# EAGLE design usbtrng (EAGLE 6.2)
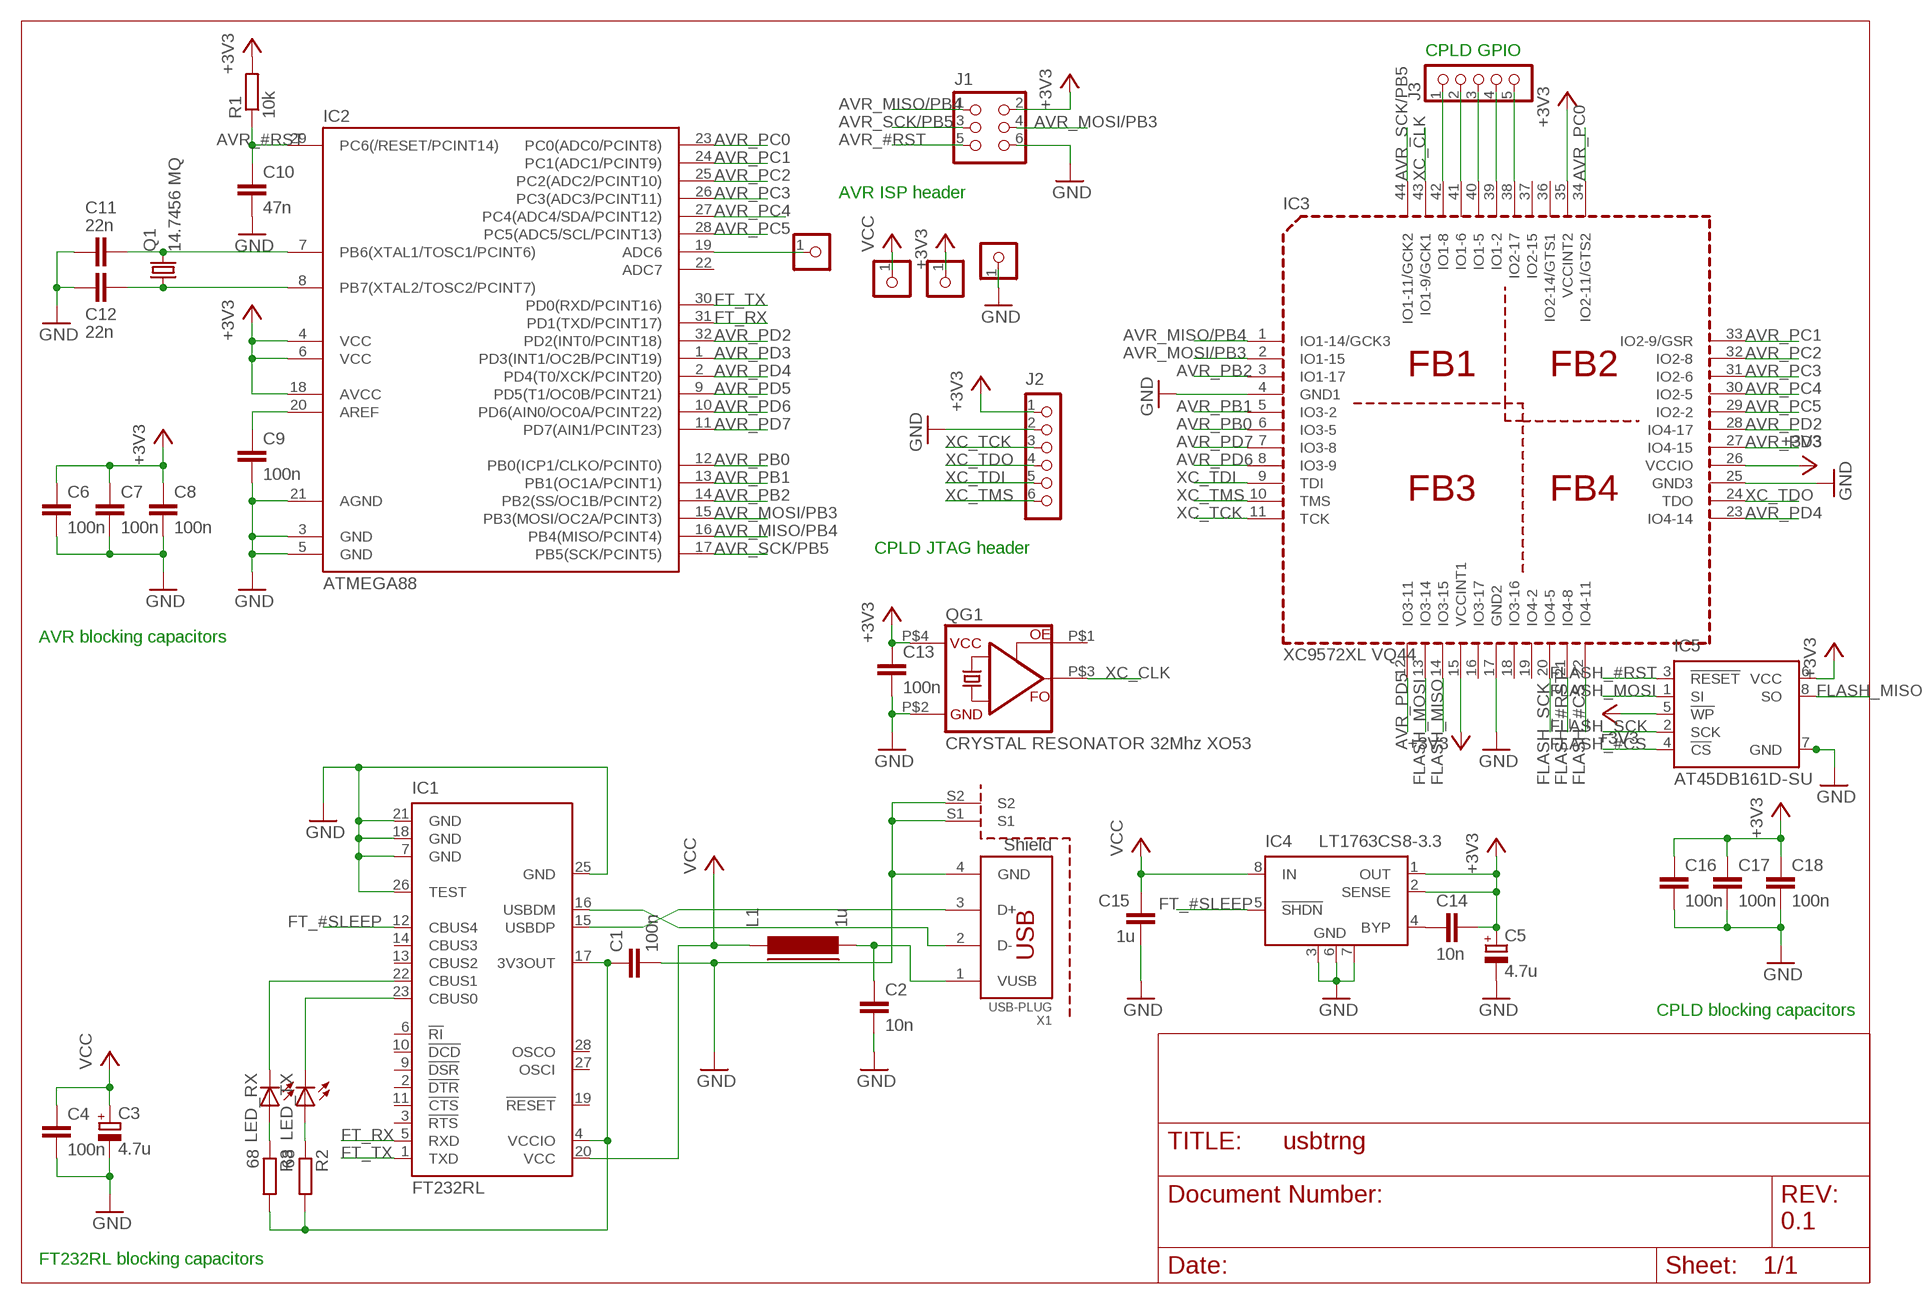
[diagram p0: schematic, sheet 1]

## Parts
C1  100n  C-EUC0805  [C0805]
C2  10n  C-EUC0805  [C0805]
C3  4.7u  CPOL-EUB  [PANASONIC_B]
C4  100n  C-EUC0805  [C0805]
C5  4.7u  CPOL-EUB  [PANASONIC_B]
C6  100n  C-EUC0805  [C0805]
C7  100n  C-EUC0805  [C0805]
C8  100n  C-EUC0805  [C0805]
C9  100n  C-EUC0805  [C0805]
C10  47n  C-EUC0805  [C0805]
C11  22n  C-EUC0805  [C0805]
C12  22n  C-EUC0805  [C0805]
C13  100n  C-EUC0805  [C0805]
C14  10n  C-EUC0805  [C0805]
C15  1u  C-EUC0805  [C0805]
C16  100n  C-EUC0805  [C0805]
C17  100n  C-EUC0805  [C0805]
C18  100n  C-EUC0805  [C0805]
IC1  FT232RL  [SSOP28]
IC2  ATMEGA88  ATMEGA48/88/168-AU  [TQFP32-08]
IC3  XC9572XL VQ44  IC_CPLD_XC9572VQ44  [VQ-44]
IC4  LT1763CS8-3.3  [SOIC8]
IC5  AT45DB161D-SU  [8S2]
J1  CON_HEADER_2X03-PTH  [M2X3]
J2  CON_HEADER_1X06-PTH  [M1X6]
J3  CON_HEADER_1X05-PTH  [M1X5]
J4  CON_HEADER_1X01-PTH  [M1X1]
J5  CON_HEADER_1X01-PTH  [M1X1]
J7  CON_HEADER_1X01-PTH  [M1X1]
J8  CON_HEADER_1X01-PTH  [M1X1]
L1  1u  FERRITE-0805  [FB805]
LED_RX  LEDCHIP-LED0805  [CHIP-LED0805]
LED_TX  LEDCHIP-LED0805  [CHIP-LED0805]
Q1  14.7456 MQ  CRYSTALMJ  [MJ]
QG1  CRYSTAL RESONATOR 32Mhz XO53  CRYSTALRESONATORXO53  [XO53]
R1  10k  R-EU_M0805  [M0805]
R2  68  R-EU_M0805  [M0805]
R3  68  R-EU_M0805  [M0805]
X1  USB-PLUG  USB-1X-2S-PLUG-A-SMD  [USB-PLUG-A-SMD-2S]

## Nets
+3V3: C5.+ C6.1 C7.1 C8.1 C13.1 C14.2 C16.1 C17.1 C18.1 IC2.4(VCC) IC2.6(VCC) IC2.18(AVCC) IC3.15(VCCINT1) IC3.26(VCCIO) IC3.35(VCCINT2) IC4.1(OUT) IC4.2(SENSE) IC5.5(!WP) IC5.6(VCC) J1.2 J2.1 J7.1 QG1.P$4(VCC) R1.2
AVR_#RST: C10.1 IC2.29(PC6(/RESET/PCINT14)) J1.5 R1.1
AVR_MISO/PB4: IC2.16(PB4(MISO/PCINT4)) IC3.1(IO1-14/GCK3) J1.1
AVR_MOSI/PB3: IC2.15(PB3(MOSI/OC2A/PCINT3)) IC3.2(IO1-15) J1.4
AVR_PB0: IC2.12(PB0(ICP1/CLKO/PCINT0)) IC3.6(IO3-5)
AVR_PB1: IC2.13(PB1(OC1A/PCINT1)) IC3.5(IO3-2)
AVR_PB2: IC2.14(PB2(SS/OC1B/PCINT2)) IC3.3(IO1-17)
AVR_PC0: IC2.23(PC0(ADC0/PCINT8)) IC3.34(IO2-11/GTS2)
AVR_PC1: IC2.24(PC1(ADC1/PCINT9)) IC3.33(IO2-9/GSR)
AVR_PC2: IC2.25(PC2(ADC2/PCINT10)) IC3.32(IO2-8)
AVR_PC3: IC2.26(PC3(ADC3/PCINT11)) IC3.31(IO2-6)
AVR_PC4: IC2.27(PC4(ADC4/SDA/PCINT12)) IC3.30(IO2-5)
AVR_PC5: IC2.28(PC5(ADC5/SCL/PCINT13)) IC3.29(IO2-2)
AVR_PD2: IC2.32(PD2(INT0/PCINT18)) IC3.28(IO4-17)
AVR_PD3: IC2.1(PD3(INT1/OC2B/PCINT19)) IC3.27(IO4-15)
AVR_PD4: IC2.2(PD4(T0/XCK/PCINT20)) IC3.23(IO4-14)
AVR_PD5: IC2.9(PD5(T1/OC0B/PCINT21)) IC3.12(IO3-11)
AVR_PD6: IC2.10(PD6(AIN0/OC0A/PCINT22)) IC3.8(IO3-9)
AVR_PD7: IC2.11(PD7(AIN1/PCINT23)) IC3.7(IO3-8)
AVR_SCK/PB5: IC2.17(PB5(SCK/PCINT5)) IC3.44(IO1-11/GCK2) J1.3
FLASH_#CS: IC3.22(IO4-11) IC5.4(!CS)
FLASH_#RST: IC3.21(IO4-8) IC5.3(!RESET)
FLASH_MISO: IC3.14(IO3-15) IC5.8(SO)
FLASH_MOSI: IC3.13(IO3-14) IC5.1(SI)
FLASH_SCK: IC3.20(IO4-5) IC5.2(SCK)
FT_#SLEEP: IC1.12(CBUS4) IC4.5(!SHDN)
FT_RX: IC1.5(RXD) IC2.31(PD1(TXD/PCINT17))
FT_TX: IC1.1(TXD) IC2.30(PD0(RXD/PCINT16))
GND: C1.2 C2.2 C3.- C4.2 C5.- C6.2 C7.2 C8.2 C9.2 C10.2 C11.1 C12.1 C13.2 C15.1 C16.2 C17.2 C18.2 IC1.7(GND) IC1.18(GND) IC1.21(GND) IC1.25(GND) IC1.26(TEST) IC2.3(GND) IC2.5(GND) IC2.21(AGND) IC3.4(GND1) IC3.17(GND2) IC3.25(GND3) IC4.3(GND) IC4.6(GND) IC4.7(GND) IC5.7(GND) J1.6 J2.2 J5.1 QG1.P$2(GND) X1.4(GND) X1.S1 X1.S2
N$1: IC1.15(USBDP) X1.3(D+)
N$2: IC1.16(USBDM) X1.2(D-)
N$3: C9.1 IC2.20(AREF)
N$4: C2.1 L1.2 X1.1(VUSB)
N$5: LED_RX.A R3.1
N$6: C1.1 IC1.4(VCCIO) IC1.17(3V3OUT) R2.2 R3.2
N$7: LED_TX.A R2.1
N$8: IC1.23(CBUS0) LED_TX.C
N$9: IC1.22(CBUS1) LED_RX.C
N$10: C11.2 IC2.7(PB6(XTAL1/TOSC1/PCINT6)) Q1.P3
N$11: C12.2 IC2.8(PB7(XTAL2/TOSC2/PCINT7)) Q1.P1
N$12: IC3.42(IO1-8) J3.1
N$13: C14.1 IC4.4(BYP)
N$14: IC3.41(IO1-6) J3.2
N$15: IC3.40(IO1-5) J3.3
N$16: IC3.39(IO1-2) J3.4
N$17: IC3.38(IO2-17) J3.5
N$18: IC2.19(ADC6) J4.1
VCC: C3.+ C4.1 C15.2 IC1.20(VCC) IC4.8(IN) J8.1 L1.1
XC_CLK: IC3.43(IO1-9/GCK1) QG1.P$3(FO)
XC_TCK: IC3.11(TCK) J2.3
XC_TDI: IC3.9(TDI) J2.5
XC_TDO: IC3.24(TDO) J2.4
XC_TMS: IC3.10(TMS) J2.6
Unconnected: IC1.2(!DTR) IC1.3(!RTS) IC1.6(!RI) IC1.9(!DSR) IC1.10(!DCD) IC1.11(!CTS) IC1.13(CBUS2) IC1.14(CBUS3) IC1.19(!RESET) IC1.27(OSCI) IC1.28(OSCO) IC2.22(ADC7) IC3.16(IO3-17) IC3.18(IO3-16) IC3.19(IO4-2) IC3.36(IO2-14/GTS1) IC3.37(IO2-15) Q1.P2(GND) Q1.P4(GND1) QG1.P$1(OE)

## Notes on the sheet
- CPLD GPIO
- AVR ISP header
- CPLD JTAG header
- AVR blocking capacitors
- CPLD blocking capacitors
- 0.1
- FT232RL blocking capacitors

## Library data of the parts
C1 C2 C4 C6-C18 = rcl:C-EU: CAPACITOR, European symbol
C3 C5 = rcl:CPOL-EU: POLARIZED CAPACITOR, European symbol
IC1 = ftdichip:FT232R: Source: http://www.ftdichip.com/Documents/DataSheets/DS_FT232R_v104.pdf; MPN: FT232RL; OC_FARNELL: 1146032; OC_NEWARK: 91K9918
IC2 = atmega8:ATMEGA48/88/168
IC3 = dp_devices:IC_CPLD_XC9572
IC4 = linear-technology:LT1763CS8: 500mA, Low Noise, LDO Micropower Regulators Source: http://cds.linear.com/docs/Datasheet/1763ff.pdf; MPN: LT1763CS8-3.3; OC_FARNELL: 1273617; OC_NEWARK: 57M6055
IC5 = atmel:AT45DB161D: 16-megabit 2.5V or 2.7V DataFlash Source: http://www.atmel.com/dyn/resources/prod_documents/doc3500.pdf; MF: ATMEL; MPN: AT45DB161D-SU; OC_FARNELL: 1455040
J1 = dp_devices:CON_HEADER_2X03
J2 = dp_devices:CON_HEADER_1X06
J3 = dp_devices:CON_HEADER_1X05
J4 J5 J7 J8 = dp_devices:CON_HEADER_1X01
L1 = dp_devices:FERRITE: Ferrite bead in various packages
LED_RX LED_TX = led:LED: LED OSRAM: - CHIPLED LG R971, LG N971, LY N971, LG Q971, LY Q971, LO R971, LY R971 LH N974, LH R974 LS Q976, LO Q976, LY Q976 LO Q996 - Hyper CHIPLED LW Q18S LB Q993, LB Q99A, LB R99A - SideLED LS A670, LO A670, LY A670, LG A670, LP A670 LB A673, LV A673, LT A673, LW A673 LH A674 LY A675 LS A676, LA A676, LO A676, LY A676, LW A676 LS A679, LY A679, LG A679 - Hyper Micro SIDELED® LS Y876, LA Y876, LO Y876, LY Y876 LT Y87S - SmartLED LW L88C, LW L88S LB L89C, LB L89S, LG L890 LS L89K, LO L89K, LY L89K LS L896, LA L896, LO L896, LY L896 - TOPLED LS T670, LO T670, LY T670, LG T670, LP T670 LSG T670, LSP T670, LSY T670, LOP T670, LYG T670 LG T671, LOG T671, LSG T671 LB T673, LV T673, LT T673, LW T673 LH T674 LS T676, LA T676, LO T676, LY T676, LB T676, LH T676, LSB T676, LW T676 LB T67C, LV T67C, LT T67C, LS T67K, LO T67K, LY T67K, LW E67C LS E67B, LA E67B, LO E67B, LY E67B, LB E67C, LV E67C, LT E67C LW T67C LS T679, LY T679, LG T679 LS T770, LO T770, LY T770, LG T770, LP T770 LB T773, LV T773, LT T773, LW T773 LH T774 LS E675, LA E675, LY E675, LS T675 LS T776, LA T776, LO T776, LY T776, LB T776 LHGB T686 LT T68C, LB T68C - Hyper Mini TOPLED® LB M676 - Mini TOPLED Santana® LG M470 LS M47K, LO M47K, LY M47K Source: http://www.osram.convergy.de LUXEON: - LUMILED® LXK2-PW12-R00, LXK2-PW12-S00, LXK2-PW14-U00, LXK2-PW14-V00 LXK2-PM12-R00, LXK2-PM12-S00, LXK2-PM14-U00 LXK2-PE12-Q00, LXK2-PE12-R00, LXK2-PE12-S00, LXK2-PE14-T00, LXK2-PE14-U00 LXK2-PB12-K00, LXK2-PB12-L00, LXK2-PB12-M00, LXK2-PB14-N00, LXK2-PB14-P00, LXK2-PB14-Q00 LXK2-PR12-L00, LXK2-PR12-M00, LXK2-PR14-Q00, LXK2-PR14-R00 LXK2-PD12-Q00, LXK2-PD12-R00, LXK2-PD12-S00 LXK2-PH12-R00, LXK2-PH12-S00 LXK2-PL12-P00, LXK2-PL12-Q00, LXK2-PL12-R00 Source: www.luxeon.com KINGBRIGHT: KA-3528ASYC Source: www.kingbright.com
Q1 = Crystals-new:CRYSTAL
QG1 = Crystals-new:CRYSTALRESONATOR
R1-R3 = rcl:R-EU_: RESISTOR, European symbol
X1 = _con-usb_1:USB-1X-2S

## Board
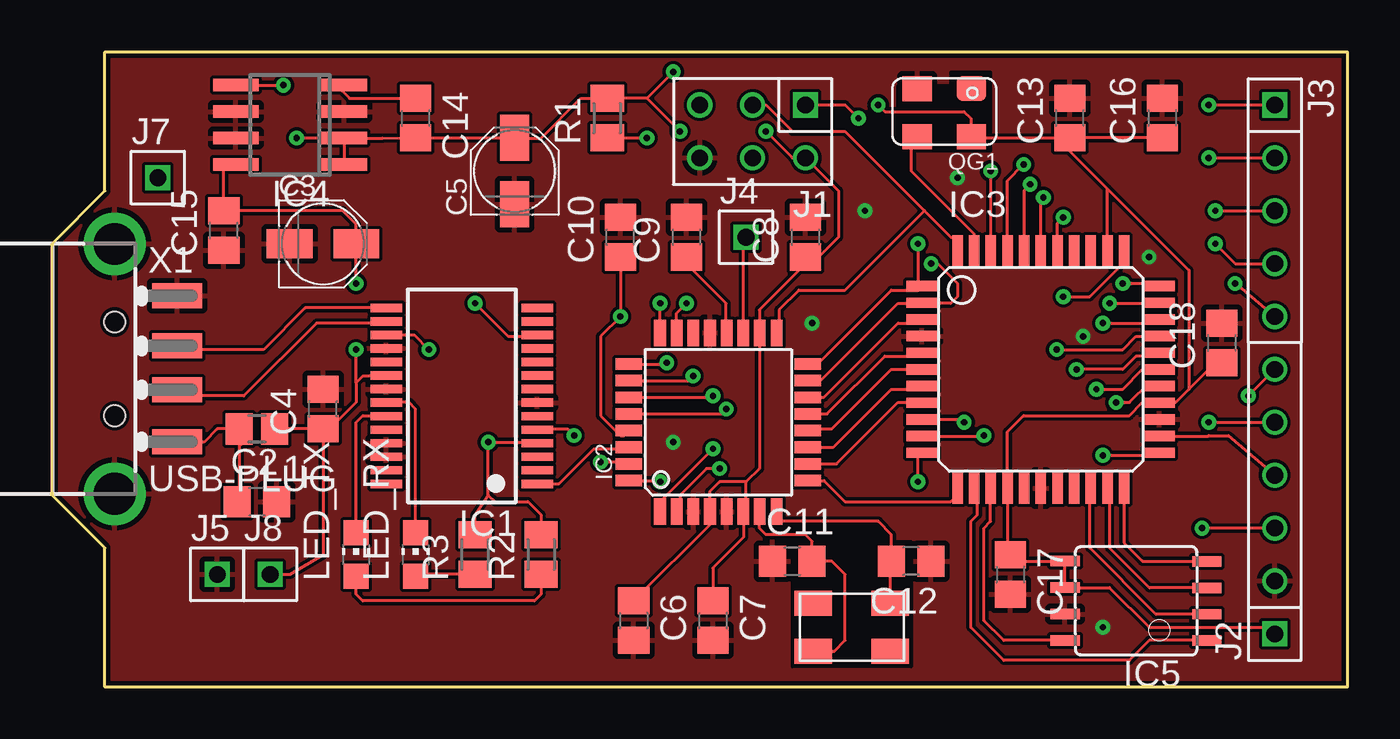
[diagram p1: board, top side]
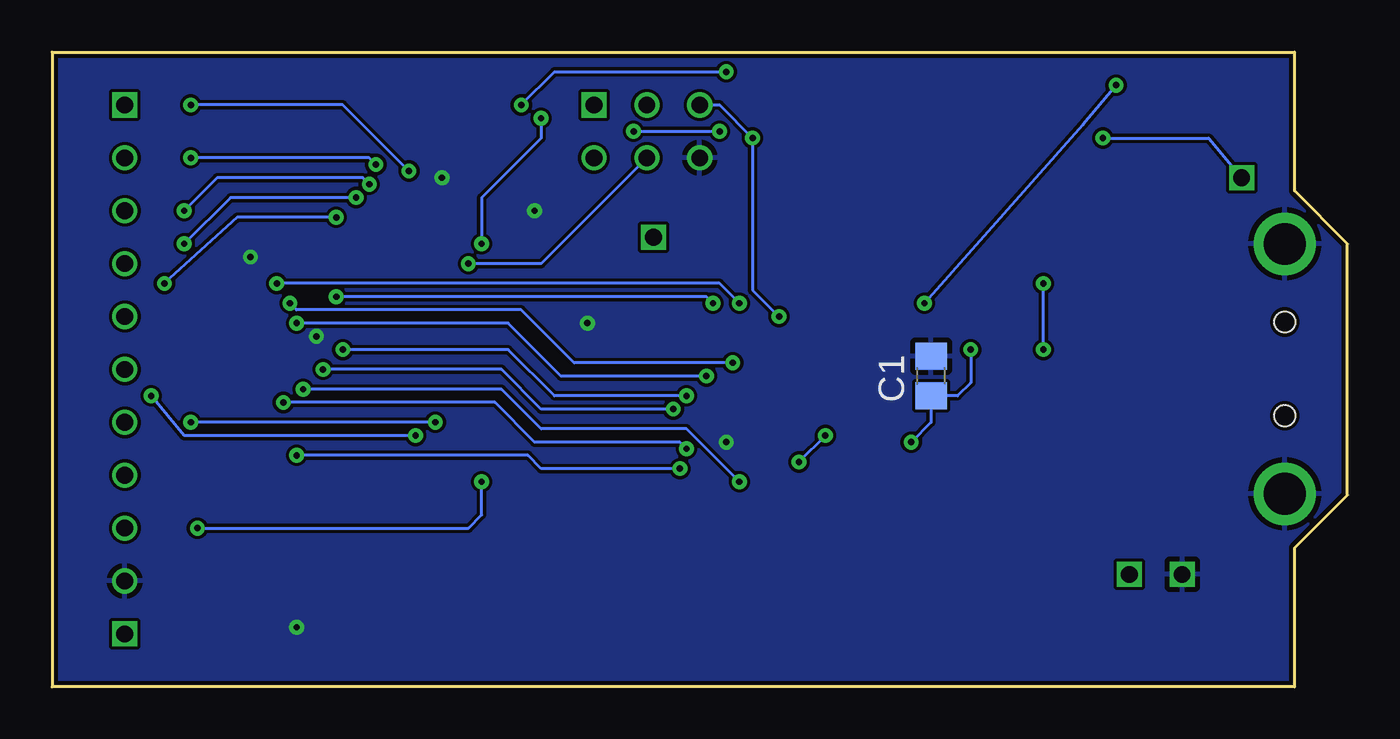
[diagram p2: board, bottom side, seen from below]

Size 62.23 x 30.48 mm. Coordinates in mm from the lower left corner, seen from the top.
Outline: 62.23,30.48 2.54,30.48 2.54,23.81 0,21.27 0,9.21 2.54,6.67 2.54,0 62.23,0 62.23,30.48
Copper layers (1+2*15+16): Top 0.035mm / dielectric 0.36mm / layer 2 0.018mm / dielectric 0.71mm / layer 15 0.018mm / dielectric 0.36mm / Bottom 0.035mm
Design rules: minimum track width 6mil, minimum drill 0.3mm, track to track 6mil, track to pad 6mil, pad to pad 6mil, via to via 6mil, smd to smd 6mil, copper to edge 8mil, drill to drill 10mil, minimum pad ring 8mil, minimum via ring 8mil, stop-mask expansion 2mil, vias tented up to drill 16mil, thermal gap 10mil

### Footprints (pad centres in the part's own frame; a part is rotated, then mirrored left to right if it is on the bottom)
C0805 = smd 1.3 x 1.5: 1 -0.95,0; 2 0.95,0
PANASONIC_B = smd 2.2 x 1.4: + 1.6,0; - -1.6,0
SSOP28 = smd 0.4 x 1.5: 1 -4.225,-3.625; 2 -3.575,-3.625; 3 -2.925,-3.625; 4 -2.275,-3.625; 5 -1.625,-3.625; 6 -0.975,-3.625; 7 -0.325,-3.625; 8 0.325,-3.625; 9 0.975,-3.625; 10 1.625,-3.625; 11 2.275,-3.625; 12 2.925,-3.625; 13 3.575,-3.625; 14 4.225,-3.625; 15 4.225,3.625; 16 3.575,3.625; 17 2.925,3.625; 18 2.275,3.625; 19 1.625,3.625; 20 0.975,3.625; 21 0.325,3.625; 22 -0.325,3.625; 23 -0.975,3.625; 24 -1.625,3.625; 25 -2.275,3.625; 26 -2.925,3.625; 27 -3.575,3.625; 28 -4.225,3.625
TQFP32-08 = smd 1.27 x 0.559: 1 -4.293,2.8; 2 -4.293,2; 3 -4.293,1.2; 4 -4.293,0.4; 5 -4.293,-0.4; 6 -4.293,-1.2; 7 -4.293,-2; 8 -4.293,-2.8; 17 4.293,-2.8; 18 4.293,-2; 19 4.293,-1.2; 20 4.293,-0.4; 21 4.293,0.4; 22 4.293,1.2; 23 4.293,2; 24 4.293,2.8 | smd 0.559 x 1.27: 9 -2.8,-4.293; 10 -2,-4.293; 11 -1.2,-4.293; 12 -0.4,-4.293; 13 0.4,-4.293; 14 1.2,-4.293; 15 2,-4.293; 16 2.8,-4.293; 25 2.8,4.293; 26 2,4.293; 27 1.2,4.293; 28 0.4,4.293; 29 -0.4,4.293; 30 -1.2,4.293; 31 -2,4.293; 32 -2.8,4.293
VQ-44 = smd 1.5 x 0.5: 1 -5.7,4; 2 -5.7,3.2; 3 -5.7,2.4; 4 -5.7,1.6; 5 -5.7,0.8; 6 -5.7,0; 7 -5.7,-0.8; 8 -5.7,-1.6; 9 -5.7,-2.4; 10 -5.7,-3.2; 11 -5.7,-4; 23 5.7,-4; 24 5.7,-3.2; 25 5.7,-2.4; 26 5.7,-1.6; 27 5.7,-0.8; 28 5.7,0; 29 5.7,0.8; 30 5.7,1.6; 31 5.7,2.4; 32 5.7,3.2; 33 5.7,4 | smd 0.5 x 1.5: 12 -4,-5.7; 13 -3.2,-5.7; 14 -2.4,-5.7; 15 -1.6,-5.7; 16 -0.8,-5.7; 17 0,-5.7; 18 0.8,-5.7; 19 1.6,-5.7; 20 2.4,-5.7; 21 3.2,-5.7; 22 4,-5.7; 34 4,5.7; 35 3.2,5.7; 36 2.4,5.7; 37 1.6,5.7; 38 0.8,5.7; 39 0,5.7; 40 -0.8,5.7; 41 -1.6,5.7; 42 -2.4,5.7; 43 -3.2,5.7; 44 -4,5.7
SOIC8 = smd 0.6 x 2.2: 1 -1.905,-2.6; 2 -0.635,-2.6; 3 0.635,-2.6; 4 1.905,-2.6; 5 1.905,2.6; 6 0.635,2.6; 7 -0.635,2.6; 8 -1.905,2.6
8S2 = smd 0.5 x 1.4: 1 -1.905,-3.404; 2 -0.645,-3.404; 3 0.625,-3.404; 4 1.895,-3.404; 5 1.905,3.404; 6 0.635,3.404; 7 -0.635,3.404; 8 -1.905,3.404
M2X3 = drill 0.8 square: 1 -2.54,-1.27 | drill 0.8: 2 -2.54,1.27; 3 0,-1.27; 4 0,1.27; 5 2.54,-1.27; 6 2.54,1.27
M1X6 = drill 0.8 square: 1 0,0 | drill 0.8: 2 2.54,0; 3 5.08,0; 4 7.62,0; 5 10.16,0; 6 12.7,0
M1X5 = drill 0.8 square: 1 -5.08,0 | drill 0.8: 2 -2.54,0; 3 0,0; 4 2.54,0; 5 5.08,0
M1X1 = drill 0.8 square: 1 0,0
FB805 = smd 1.3 x 1.5: 1 -0.85,0; 2 0.85,0
CHIP-LED0805 = smd 1.2 x 1.2: A 0,-1.05; C 0,1.05
MJ = smd 1.8 x 1.2: P1 -1.85,-1.15; P2 1.85,-1.15; P3 1.85,1.15; P4 -1.85,1.15
XO53 = smd 1.4 x 1.2: P$1 -1.3,-1.1; P$2 1.3,-1.1; P$3 1.3,1.2; P$4 -1.3,1.2
M0805 = smd 1.3 x 1.6: 1 -0.95,0; 2 0.95,0
USB-PLUG-A-SMD-2S = smd 2.4 x 1.2: 1 10.9,-3.6; 2 10.9,-1.1; 3 10.9,1; 4 10.9,3.4 | drill 2: S1 7.9,-6.1; S2 7.9,5.9 | hole 1: 7.9,-2.35; 7.9,2.15

### Placement (x,y rotation side)
C1  20,14.92 90 bottom
C2  9.84,8.89 0 top
C3  13.02,21.27 0 top
C4  13.02,13.34 90 top
C5  22.23,24.77 90 top
C6  27.94,3.17 270 top
C7  31.75,3.17 270 top
C8  36.2,21.59 90 top
C9  30.48,21.59 90 top
C10  27.3,21.59 90 top
C11  35.56,6.03 0 top
C12  41.27,6.03 180 top
C13  48.9,27.3 90 top
C14  17.46,27.3 270 top
C15  8.26,21.91 90 top
C16  53.34,27.3 90 top
C17  46.04,5.4 270 top
C18  56.2,16.51 90 top
IC1  19.68,13.97 90 top
IC2  32,12.7 90 top
IC3  47.5,15.24 0 top
IC4  11.43,26.99 90 top
IC5  52.07,4.13 90 top
J1  33.66,26.67 180 top
J2  58.74,2.54 90 top
J3  58.74,22.86 270 top
J4  33.34,21.59 0 top
J5  7.94,5.4 0 top
J7  5.08,24.45 0 top
J8  10.48,5.4 0 top
L1  9.84,12.38 180 top
LED_RX  17.46,6.35 0 top
LED_TX  14.61,6.35 0 top
Q1  38.42,2.86 180 top
QG1  42.86,27.62 180 top
R1  26.67,27.3 90 top
R2  23.5,6.35 90 top
R3  20.32,6.35 90 top
X1  -4.89,15.37 0 top

### Tracks (layer width: path | path; a pad name or v marks a point on that pad's centre or on a via)
+3V3  (via drill 0.3 pad 0.61)
  Top 0.152: C16.1 C13.1 48.58,26.36 48.58,26.35 | 48.58,26.35 44.09,26.35 QG1.P$4 44.13,26.45 44.13,27.3 43.81,27.62 40.01,27.62 v39.69,27.94 | IC4.2 15.87,26.35 C14.2 22.22,26.36 22.23,26.35 | IC4.2 IC4.1 | v34.29,26.67 35.56,25.4 J1.2 37.78,23.81 37.78,21.59 36.51,20.32 C8.1 36.2,20.32 33.97,18.1 33.97,17.02 IC2.18 33.97,16.99 33.97,10.48 33.34,9.84 | v30.16,26.67 28.57,28.26 | 28.57,28.26 R1.2 | R1.2 | 50.8,21.04 IC3.35 | 54.61,14.29 54.61,20 50.7,23.91 | 54.61,14.29 53.98,13.65 53.21,13.65 IC3.26 52.4,13.64 52.39,13.65 51.75,13.02 46.67,13.02 45.9,12.24 IC3.15 45.9,6.49 C17.1 46.03,6.03 | v29.84,29.53 28.57,28.26 | C7.1 31.75,5.71 33.2,7.17 IC2.6 33.34,8.27 | 50.7,23.91 48.58,26.04 48.58,26.35 | IC3.35 50.7,23.91 | 54.61,14.29 55.88,15.56 C18.1 | C6.1 31.75,7.93 31.75,8.89 31.59,8.73 | 31.59,8.73 31.43,8.57 | 31.43,8.57 31.43,7.94 | 33.34,8.27 33.34,9.84 | 33.34,9.84 32.07,9.84 31.59,9.37 31.59,8.73 | 22.23,26.35 23.5,26.35 25.4,28.26 R1.2 | IC4.2 v11.75,26.35 | C5.+ 22.23,26.35 | 33.34,8.26 33.34,8.27 | 31.43,8.57 31.44,8.57 IC2.4 | 50.7,20.85 IC3.35 | 46.03,6.03 46.04,6.03 | J2.1 58.42,2.86 52.7,2.86 50.8,4.76 IC5.6 IC5.5 48.58,6.03 | 46.03,6.03 48.58,6.03 | 48.26,6.03 48.58,6.03
  Bottom 0.152: v34.29,26.67 v30.16,26.67 | v39.69,27.94 38.1,29.53 v29.84,29.53 | v11.75,26.35 6.67,26.35 J7.1
AVR_#RST  (via drill 0.3 pad 0.61)
  Top 0.152: R1.1 v28.57,26.36 v28.57,26.35 | IC2.29 27.48,12.06 27.3,12.06 26.35,13.02 26.35,16.83 v27.3,17.78 C10.1
  Bottom 0.152: v27.3,17.78 28.57,19.05 v28.57,26.35 30.16,27.94 J1.5
AVR_MISO/PB4  (via drill 0.3 pad 0.61)
  Top 0.152: IC2.16 36.77,15.5 40.32,19.05 41.61,19.05 IC3.1 41.59,19.45 v41.59,21.27 | J1.1 38.1,27.94 v38.73,27.3
  Bottom 0.152: v38.73,27.3 38.73,26.35 41.59,23.5 v41.59,21.27
AVR_MOSI/PB3  (via drill 0.3 pad 0.61)
  Top 0.152: IC2.15 36.92,14.7 40.64,18.41 41.77,18.41 IC3.2 41.82,18.41 43.18,18.41 43.5,18.73 43.5,19.37 42.55,20.32 v42.23,20.32
  Bottom 0.152: J1.4 38.73,20.32 v42.23,20.32
AVR_PB0
  Top 0.152: IC2.12 36.43,12.3 36.51,12.38 37.47,12.38 40.32,15.24 IC3.6
AVR_PB1
  Top 0.152: IC2.13 37.23,13.1 40.01,15.88 41.27,15.88 41.44,16.04 IC3.5
AVR_PB2
  Top 0.152: IC2.14 37.08,13.9 40.64,17.46 41.62,17.46 IC3.3
AVR_PC0  (via drill 0.3 pad 0.61)
  Top 0.152: IC2.23 30,17.94 v30.48,18.41 | IC3.34 51.44,20.88 51.44,20.32 49.85,18.73 v48.58,18.73
  Bottom 0.152: v30.48,18.41 30.8,18.73 v48.58,18.73
AVR_PC1  (via drill 0.3 pad 0.61)
  Top 0.152: IC2.24 v29.2,18.41 v29.21,18.41 | v51.44,19.37 53.07,19.37 IC3.33
  Bottom 0.152: v29.21,18.41 30.16,19.37 v51.44,19.37
AVR_PC2  (via drill 0.3 pad 0.61)
  Top 0.152: IC2.25 29.47,15.5 v29.53,15.56 | v50.8,18.41 53.17,18.41 IC3.32
  Bottom 0.152: v29.53,15.56 37.15,15.56 39.69,18.1 50.48,18.1 v50.8,18.41
AVR_PC3  (via drill 0.3 pad 0.61)
  Top 0.152: IC2.26 30.57,14.7 v30.8,14.92 | v50.48,17.46 53.02,17.46 IC3.31
  Bottom 0.152: v30.8,14.92 37.78,14.92 40.32,17.46 v50.48,17.46
AVR_PC4  (via drill 0.3 pad 0.61)
  Top 0.152: IC2.27 31.68,13.9 v31.75,13.97 | v48.26,16.19 51.44,16.19 52.07,16.83 53.19,16.83 IC3.30
  Bottom 0.152: v31.75,13.97 38.1,13.97 40.32,16.19 v48.26,16.19
AVR_PC5  (via drill 0.3 pad 0.61)
  Top 0.152: IC2.28 32.15,13.1 v32.38,13.34 | v49.21,15.24 51.44,15.24 52.07,15.88 52.39,15.88 52.55,16.04 IC3.29
  Bottom 0.152: v32.38,13.34 38.73,13.34 40.64,15.24 v49.21,15.24
AVR_PD2  (via drill 0.3 pad 0.61)
  Top 0.152: v50.16,14.29 51.44,14.29 52.39,15.24 IC3.28 | IC2.32 29.15,9.9 v29.21,9.84
  Bottom 0.152: v29.21,9.84 31.75,12.38 38.73,12.38 40.64,14.29 v50.16,14.29
AVR_PD3  (via drill 0.3 pad 0.61)
  Top 0.152: IC2.1 29.2,8.88 v31.75,11.43 | v51.12,13.65 51.75,13.65 52.7,14.61 52.87,14.44 IC3.27
  Bottom 0.152: v31.75,11.43 32.07,11.75 39.05,11.75 40.96,13.65 v51.12,13.65
AVR_PD4  (via drill 0.3 pad 0.61)
  Top 0.152: 30,8.73 IC2.2 30.16,8.57 30.16,9.21 31.43,10.48 v32.07,10.48 | v50.48,11.11 53.07,11.11 IC3.23
  Bottom 0.152: v32.07,10.48 38.73,10.48 39.37,11.11 v50.48,11.11
AVR_PD5
  Top 0.152: IC2.9 37.09,9.9 38.1,8.89 43.18,8.89 43.5,9.21 IC3.12
AVR_PD6
  Top 0.152: IC2.10 37.69,10.7 40.64,13.65 41.78,13.65 IC3.8
AVR_PD7
  Top 0.152: IC2.11 37.53,11.5 40.32,14.29 41.65,14.29 IC3.7
AVR_SCK/PB5
  Top 0.152: 43.48,20.95 IC3.44 43.5,21.59 | J1.3 34.29,27.94 35.56,26.67 38.1,26.67 41.91,22.86 | IC2.17 34.92,17.11 34.92,18.1 35.88,19.05 38.1,19.05 41.91,22.86 | 43.5,21.59 43.18,21.59 41.91,22.86 | 43.5,21.59
FLASH_#CS
  Top 0.152: IC3.22 51.5,6.92 52.39,6.03 55.24,6.03 55.46,6.03 | 55.56,6.03 55.46,6.03 | 55.46,6.03 IC5.4
FLASH_#RST
  Top 0.152: IC5.3 52.72,4.75 50.8,6.67 50.8,9.12 IC3.21
FLASH_MISO
  Top 0.152: IC5.8 45.72,2.22 44.77,3.17 44.77,7.62 45.09,7.94 45.09,9.53 IC3.14
FLASH_MOSI
  Top 0.152: IC5.1 52.7,2.22 51.75,1.27 45.72,1.27 44.13,2.86 44.13,7.94 44.45,8.26 44.45,9.39 IC3.13
FLASH_SCK
  Top 0.152: IC5.2 53.03,3.48 49.85,6.67 49.85,9.53 49.86,9.54 IC3.20
FT_#SLEEP  (via drill 0.3 pad 0.61)
  Top 0.152: IC4.5 v11.11,28.89 | v20.32,18.41 21.91,16.83 23.24,16.83 IC1.12
  Bottom 0.152: v11.11,28.89 12.7,26.99 v20.32,18.41
FT_RX  (via drill 0.3 pad 0.61)
  Top 0.152: IC1.5 23.21,12.35 23.18,12.38 24.77,12.38 v25.08,12.06 | IC2.31 27.62,10.79 v26.35,10.79
  Bottom 0.152: v25.08,12.06 v26.35,10.79
FT_TX
  Top 0.152: IC1.1 24.35,9.74 26.04,11.43 27.64,11.43 IC2.30
GND  (via drill 0.3 pad 0.61)
  other vias: 49.53,16.83 52.7,20.64 43.5,24.45 36.51,17.46 39.05,22.86 50.48,2.86 29.84,11.75
  pour Bottom: 0,30.48 62.29,30.48 62.29,0 0,0
  pour Top: 0,30.48 62.29,30.48 62.29,0 0,0
  pour Top: 6.99,3.81 6.99,0.64 8.57,0.64 8.57,3.81
  pour Top: 9.84,3.81 9.84,0.64 11.43,0.64 11.43,3.81
  pour Top: 4.45,29.21 4.45,26.04 6.03,26.04 6.03,29.21
  pour Top: 60.01,24.77 60.01,20.95 61.59,20.95 61.59,24.77
  pour Top: 60.01,13.34 60.01,4.45 61.59,4.45 61.59,13.34
  pour Bottom: 3.17,0.64 46.35,0.64 46.35,2.22 3.17,2.22
  pour Bottom: 3.17,2.22 35.56,2.22 35.56,3.81 3.17,3.81
  pour Top: 28.57,25.72 28.57,24.13 29.84,24.13 29.84,25.72
  pour Top: 60.01,28.57 60.01,27.3 61.59,27.3 61.59,28.57
  pour Top: 60.01,3.17 60.01,1.91 61.59,1.91 61.59,3.17
N$1
  Top 0.152: IC1.15 12.16,18.2 10.16,16.19 5.87,16.19 X1.3
N$2
  Top 0.152: IC1.16 15.98,17.46 12.7,17.46 9.21,13.97 6.03,13.97 5.86,14.14 X1.2
N$3
  Top 0.152: IC2.20 32.38,17.01 32.38,18.41 30.48,20.32 C9.1
N$4
  Top 0.152: 9.1,11.64 9.21,11.75 8.99,11.96 L1.2 | L1.2 7.94,12.38 7.3,11.75 6.35,11.75 6.24,11.64 X1.1 | L1.2 8.99,9.31 8.89,9.21 C2.1
N$5
  Top 0.152: R3.1 17.46,5.4 LED_RX.A
N$6  (via drill 0.3 pad 0.61)
  Top 0.152: IC1.17 17.39,16.89 v18.1,16.19 | IC1.4 23.26,11.75 v20.95,11.75 20.95,9.21 | R3.2 20.32,8.26 20.95,9.21 | 20.95,9.21 21.27,8.89 22.86,8.89 23.5,8.26 R2.2
  Bottom 0.152: v18.1,16.19 18.1,14.61 18.73,13.97 C1.1 | v20.95,11.75 20,12.7 C1.1 | C1.1
N$7
  Top 0.152: R2.1 23.5,4.45 23.18,4.13 14.92,4.13 14.61,4.45 LED_TX.A
N$8
  Top 0.152: IC1.23 16.04,13.02 14.92,13.02 14.61,12.7 LED_TX.C
N$9
  Top 0.152: IC1.22 17.14,13.65 17.46,13.34 LED_RX.C
N$10
  Top 0.152: Q1.P3 37.59,1.71 38.1,2.22 38.1,5.4 37.47,6.03 C11.2 36.51,6.35 | 36.51,6.35 36.51,6.99 36.2,7.3 34.29,7.3 33.97,7.62 33.97,8.38 IC2.7 | C11.2 36.51,6.35
N$11
  Top 0.152: Q1.P1 40.27,5.98 C12.2 | C12.2 40.32,7.3 39.69,7.94 34.92,7.94 34.8,8.06 IC2.8 | C12.2
N$12  (via drill 0.3 pad 0.61)
  Top 0.152: IC3.42 v45.1,24.78 v45.09,24.77 | v55.56,27.94 J3.1
  Bottom 0.152: v45.09,24.77 48.26,27.94 v55.56,27.94
N$13
  Top 0.152: IC4.4 13.65,28.89 14.29,28.26 15.87,28.26 C14.1
N$14  (via drill 0.3 pad 0.61)
  Top 0.152: IC3.41 45.9,24.31 v46.67,25.08 | v55.56,25.4 J3.2
  Bottom 0.152: v46.67,25.08 46.99,25.4 v55.56,25.4
N$15  (via drill 0.3 pad 0.61)
  Top 0.152: IC3.40 46.7,23.84 v46.99,24.13 | v55.88,22.86 J3.3
  Bottom 0.152: v46.99,24.13 47.31,24.45 54.29,24.45 v55.88,22.86
N$16  (via drill 0.3 pad 0.61)
  Top 0.152: IC3.39 47.5,23.37 v47.62,23.5 | v55.88,21.27 56.83,20.32 J3.4
  Bottom 0.152: v47.62,23.5 53.66,23.5 v55.88,21.27
N$17  (via drill 0.3 pad 0.61)
  Top 0.152: IC3.38 48.3,22.26 v48.58,22.54 | v56.83,19.37 J3.5
  Bottom 0.152: v48.58,22.54 53.34,22.54 v56.83,19.37
N$18
  Top 0.152: IC2.19 33.2,21.46 J4.1
N$19
  cutout Top: 35.56,6.99 41.27,6.99 41.27,0.95 35.56,0.95
N$20
  cutout Top: 40.64,28.89 45.09,28.89 45.09,25.72 40.64,25.72
N$21
  cutout Top: 43.18,29.53 45.09,29.53 45.09,27.94 43.18,27.94
VCC  (via drill 0.3 pad 0.61)
  Top 0.152: 10.8,11.75 10.79,11.75 L1.1 C4.1 | IC1.20 15.26,14.95 15.24,14.92 14.92,14.92 14.61,14.61 | 14.61,14.61 14.61,13.65 13.65,12.7 13.33,12.7 C4.1 | C4.1 13.02,6.35 11.43,5.4 J8.1 | 14.61,14.61 v14.61,16.19 | v14.61,19.37 14.61,21.27 C3.+ 14.62,22.21 13.97,22.86 C15.2 | 8.57,25.08 IC4.8 8.26,25.08 C15.2 | C15.2
  Bottom 0.152: v14.61,16.19 v14.61,19.37
XC_CLK
  Top 0.152: IC3.43 44.3,21.74 41.27,24.77 41.27,26.07 QG1.P$3
XC_TCK  (via drill 0.3 pad 0.61)
  Top 0.152: J2.3 v55.24,7.62 | v41.59,9.84 41.59,11.03 IC3.11
  Bottom 0.152: v55.24,7.62 42.23,7.62 41.59,8.26 v41.59,9.84
XC_TDI  (via drill 0.3 pad 0.61)
  Top 0.152: IC3.9 43.67,12.84 v43.81,12.7 | v55.56,12.7 J2.5
  Bottom 0.152: v43.81,12.7 v55.56,12.7
XC_TDO
  Top 0.152: IC3.24 55.54,12.04 55.56,12.06 56.52,12.06 J2.4
XC_TMS  (via drill 0.3 pad 0.61)
  Top 0.152: IC3.10 44.42,12.04 44.45,12.06 v44.77,12.06 | v57.47,13.97 J2.6
  Bottom 0.152: v44.77,12.06 55.88,12.06 v57.47,13.97

### Text on the board
tRestrict: 1 | 3V3 | 6 | GPIO | CPLD JTAG | 1 | GND | VCC
bRestrict: USB-AVR-CPLD experimental board v0.1 | (c) 2012 by T. Meissner - www.github.com/tmeissner